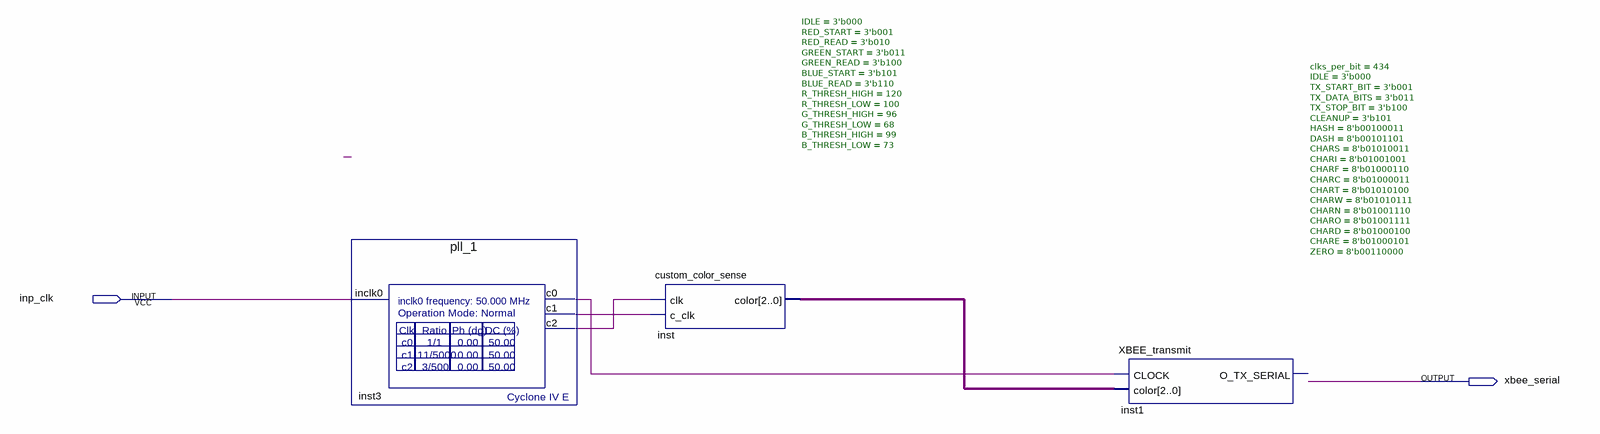
[diagram p0: schematic sheet]
// Quartus schematic custom_xbee_test.bdf as structural Verilog: 3 symbols, 2 pins
module custom_xbee_test (
  input  inp_clk,
  output xbee_serial
);

  wire inst3_c0, inst3_c1, inst3_c2;
  wire [2:0] inst_color;

  pll_1 inst3 (.inclk0(inp_clk), .c0(inst3_c0), .c1(inst3_c1), .c2(inst3_c2));
  custom_color_sense #(.IDLE(3'b000), .RED_START(3'b001), .RED_READ(3'b010), .GREEN_START(3'b011), .GREEN_READ(3'b100), .BLUE_START(3'b101), .BLUE_READ(3'b110), .R_THRESH_HIGH(120), .R_THRESH_LOW(100), .G_THRESH_HIGH(96), .G_THRESH_LOW(68), .B_THRESH_HIGH(99), .B_THRESH_LOW(73)) inst (
    .clk(inst3_c2), .c_clk(inst3_c1), .color(inst_color));
  XBEE_transmit #(.clks_per_bit(434), .IDLE(3'b000), .TX_START_BIT(3'b001), .TX_DATA_BITS(3'b011), .TX_STOP_BIT(3'b100), .CLEANUP(3'b101), .HASH(8'b00100011), .DASH(8'b00101101), .CHARS(8'b01010011), .CHARI(8'b01001001), .CHARF(8'b01000110), .CHARC(8'b01000011), .CHART(8'b01010100), .CHARW(8'b01010111), .CHARN(8'b01001110), .CHARO(8'b01001111), .CHARD(8'b01000100), .CHARE(8'b01000101), .ZERO(8'b00110000)) inst1 (
    .CLOCK(inst3_c0), .color(inst_color));  // open: O_TX_SERIAL
endmodule
